# Altium schematic sheet tay cam.SchDoc
size A
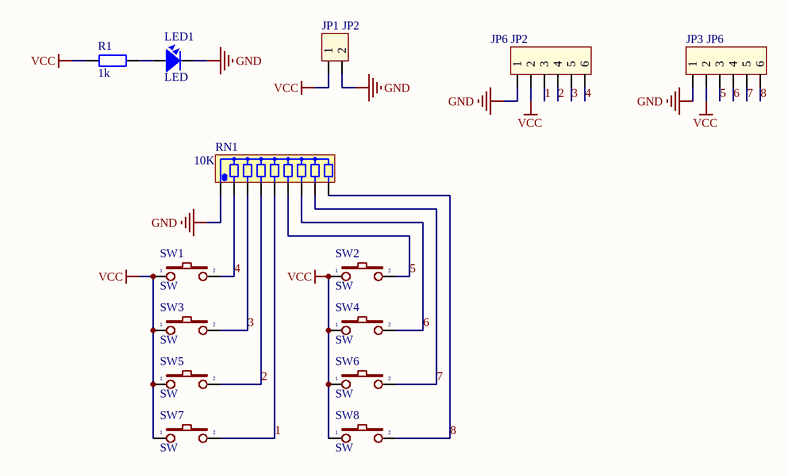
[diagram p0: tay cam.SchDoc]

## Parts
JP1  JP2  [CON2]
JP2  JP6  [CON6]
JP3  JP6  [CON6]
LED1  LED  [LED-3]
R1  1k  [R1/4W]
RN1  10K  [RN8]
SW1  SW  [SW4]
SW2  SW  [SW4]
SW3  SW  [SW4]
SW4  SW  [SW4]
SW5  SW  [SW4]
SW6  SW  [SW4]
SW7  SW  [SW4]
SW8  SW  [SW4]

## Nets
GND: JP1.2 JP2.1 JP3.1 LED1.2 RN1.1
VCC: JP1.1 JP2.2 JP3.2 R1.1 SW1.1 SW2.1 SW3.1 SW4.1 SW5.1 SW6.1 SW7.1 SW8.1
1: JP2.3 RN1.5 SW7.2
2: JP2.4 RN1.4 SW5.2
3: JP2.5 RN1.3 SW3.2
4: JP2.6 RN1.2 SW1.2
5: JP3.3 RN1.6 SW2.2
6: JP3.4 RN1.7 SW4.2
7: JP3.5 RN1.8 SW6.2
8: JP3.6 RN1.9 SW8.2
NetLED1_1: LED1.1 R1.2

## Library data of the parts
JP1 = Con2: Connector 2; Value: Connector 2
JP2 JP3 = Con6: Connector 6; Value: Connector 6
LED1 = LED: LED Single colour Green and Red; Value: LED 3 ly Single Colour; Description: LED 5 ly Single Colour; Description: Led  Vuong
R1 = R1/4W: Resistor 1/4W; Value: R1/4W - 1K
RN1 = RN8: Resistor 8 (Thanh); Value: Tro thanh 10K
SW1-SW8 = SW2: Switch button 2 pin; Value: SW chip 2 pin